# Altium schematic sheet teensyPlayback.SchDoc
size Legal
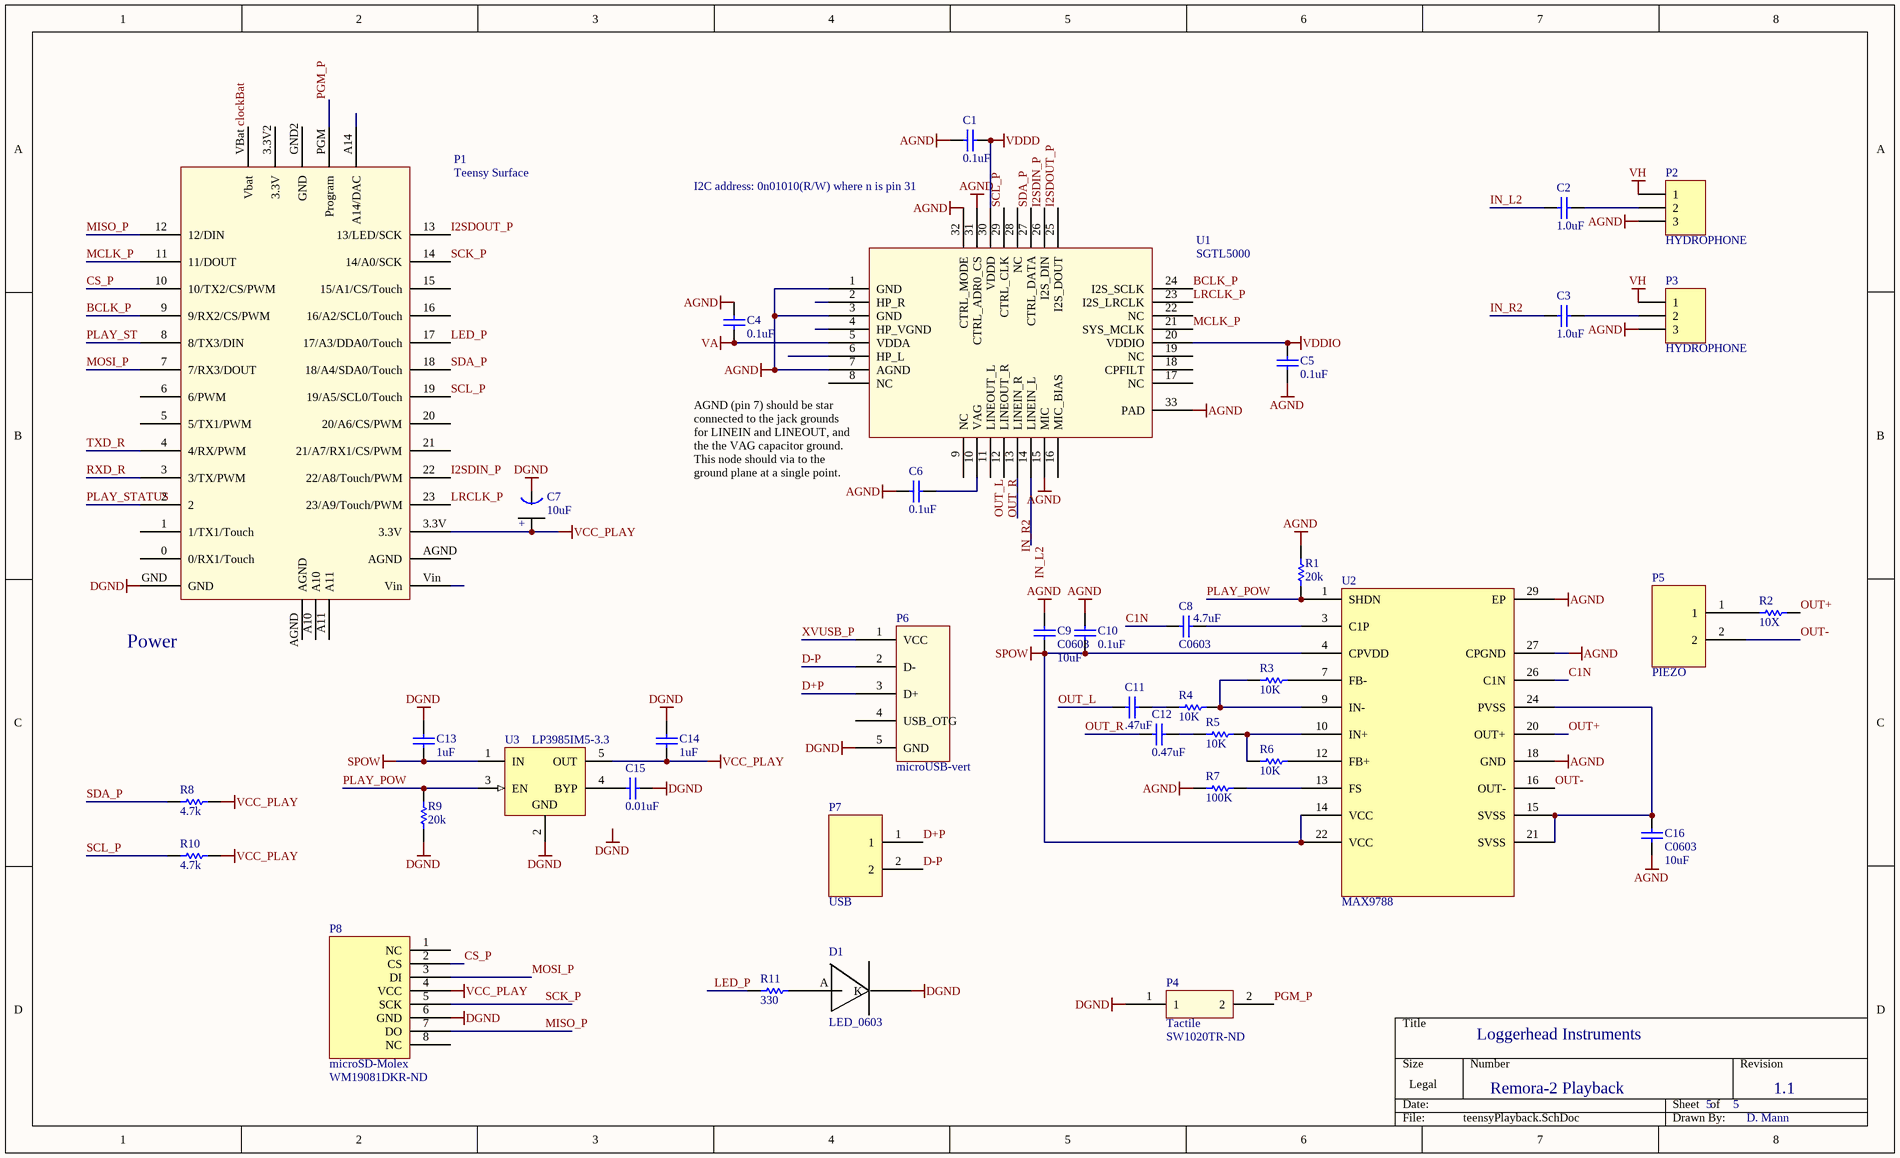
[diagram p0: teensyPlayback.SchDoc]

## Parts
C1  0.1uF  [0402]
C2  1.0uF  [0402]
C3  1.0uF  [0402]
C4  0.1uF  [0402]
C5  0.1uF  [0402]
C6  0.1uF  [0402]
C7  10uF  [Tant0805]
C8  C0603  value 4.7uF  [0603]
C9  C0603  value 10uF  [0603]
C10  0.1uF  [0402]
C11  .47uF  [0402]
C12  0.47uF  [0402]
C13  1uF  [0402]
C14  1uF  [0402]
C15  0.01uF  [0402]
C16  C0603  value 10uF  [0603]
D1  LED_0603  [Diode0603]
P1  Teensy Surface  [TEENSY3.2_surface_mount]
P2  HYDROPHONE  [HDR1X3]
P3  HYDROPHONE  [HDR1X3]
P4  Tactile  Supplier Part Number 1: SW1020TR-ND  [Tactile-B3U-1000]
P5  PIEZO  [HDR_2x1_2mm]
P6  microUSB-vert  [MICROUSB-VERT]
P7  USB  [HDR_2x1_2mm]
P8  microSD-Molex  Supplier Part Number 1: WM19081DKR-ND  [microSD_Molex_hinged]
R1  20k  [3-0603]
R2  10X  [3-0603]
R3  10K  [3-0603]
R4  10K  [3-0603]
R5  10K  [3-0603]
R6  10K  [3-0603]
R7  100K  [3-0603]
R8  4.7k  [3-0603]
R9  20k  [3-0603]
R10  4.7k  [3-0603]
R11  330  [3-0603]
U1  SGTL5000  [QFN32]
U2  MAX9788  [MAX9788]
U3  LP3985IM5-3.3  [MF05A_N]

## Nets
AGND: C1.2 C4.2 C5.2 C6.2 C9.1 C10.2 C16.1 P2.3 P3.3 R1.1 R7.1 U1.1(GND) U1.3(GND) U1.7(AGND) U1.15(MIC) U1.31(CTRL_ADR0_CS) U1.32(CTRL_MODE) U1.33(PAD) U2.18(GND) U2.27(CPGND) U2.29(EP)
DGND: C7.1(GND) C13.2 C14.2 C15.2 D1.K P1.GND P4.1 P6.5(GND) P8.6(GND) R9.1 U3.2(GND)
SPOW: C9.2 C10.1 C13.1 U2.4(CPVDD) U2.14(VCC) U2.22(VCC) U3.1(IN)
VA: C4.1 U1.5(VDDA)
VCC_PLAY: C7.2(+) C14.1 P1.3.3V P8.4(VCC) R8.2 R10.2 U3.5(OUT)
VDDD: C1.1 U1.30(VDDD)
VDDIO: C5.1 U1.20(VDDIO)
VH: P2.1 P3.1
BCLK_P: P1.9(9/RX2/CS/PWM) U1.24(I2S_SCLK)
C1N: C8.1 U2.26(C1N)
clockBat: P1.VBat(Vbat)
CS_P: P1.10(10/TX2/CS/PWM) P8.2(CS)
D+P: P6.3(D+) P7.1
D-P: P6.2(D-) P7.2
I2SDIN_P: P1.22(22/A8/Touch/PWM) U1.26(I2S_DIN)
I2SDOUT_P: P1.13(13/LED/SCK) U1.25(I2S_DOUT)
IN_L2: C2.2 U1.14(LINEIN_L)
IN_R2: C3.2 U1.13(LINEIN_R)
LED_P: P1.17(17/A3/DDA0/Touch) R11.1
LRCLK_P: P1.23(23/A9/Touch/PWM) U1.23(I2S_LRCLK)
MCLK_P: P1.11(11/DOUT) U1.21(SYS_MCLK)
MISO_P: P1.12(12/DIN) P8.7(DO)
MOSI_P: P1.7(7/RX3/DOUT) P8.3(DI)
OUT+: R2.1 U2.20(OUT+)
OUT-: P5.2 U2.16(OUT-)
OUT_L: C11.2 U1.11(LINEOUT_L)
OUT_R: C12.2 U1.12(LINEOUT_R)
PGM_P: P1.PGM(Program) P4.2
PLAY_POW: R1.2 R9.2 U2.1(SHDN) U3.3(EN)
PLAY_ST: P1.8(8/TX3/DIN)
PLAY_STATUS: P1.2
RXD_R: P1.3(3/TX/PWM)
SCK_P: P1.14(14/A0/SCK) P8.5(SCK)
SCL_P: P1.19(19/A5/SCL0/Touch) R10.1 U1.29(CTRL_CLK)
SDA_P: P1.18(18/A4/SDA0/Touch) R8.1 U1.27(CTRL_DATA)
TXD_R: P1.4(4/RX/PWM)
XVUSB_P: P6.1(VCC)
NetC2_1: C2.1 P2.2
NetC3_1: C3.1 P3.2
NetC6_1: C6.1 U1.10(VAG)
NetC8_2: C8.2 U2.3(C1P)
NetC11_1: C11.1 R4.1
NetC12_1: C12.1 R5.1
NetC15_1: C15.1 U3.4(BYP)
NetC16_2: C16.2 U2.15(SVSS) U2.21(SVSS) U2.24(PVSS)
NetD1_A: D1.A R11.2
NetP5_1: P5.1 R2.2
NetR3_1: R3.1 R4.2 U2.9(IN-)
NetR3_2: R3.2 U2.7(FB-)
NetR5_2: R5.2 R6.1 U2.10(IN+)
NetR6_2: R6.2 U2.12(FB+)
NetR7_2: R7.2 U2.13(FS)

Not connected (* = marked no-connect by the designer): P1 0(0/RX1/Touch) 1(1/TX1/Touch) 3.3V2(3.3V) 5(5/TX1/PWM) 6(6/PWM) 15(15/A1/CS/Touch) 16(16/A2/SCL0/Touch) 20(20/A6/CS/PWM) 21(21/A7/RX1/CS/PWM) A10 A11 A14(A14/DAC) AGND GND2(GND) Vin; P6 4(USB_OTG); P8 1(NC) 8(NC); U1 2(HP_R) 4(HP_VGND) 6(HP_L) 8(NC) 9(NC) 16(MIC_BIAS) 17(NC) 18(CPFILT) 19(NC) 22(NC) 28(NC)

## Notes on the sheet
- I2C address: 0n01010(R/W) where n is pin 31
- (near U1) AGND (pin 7) should be star connected to the jack grounds for LINEIN and LINEOUT, and the the VAG capacitor ground. This node should via to the ground plane at a single point.
- (near P1) Power
- Loggerhead Instruments
- Remora-2 Playback
- 5
- 1.1
- D. Mann
- Labels drawn without touching a wire or pin: DGND

## Library data of the parts
C1 C4-C6 C10 = C0402: Ceramic Chip Capacitor - Standard; Note: Footprint corresponds to dimensions for bulk cassette packaging. This case size has tightened tolerances.; Published: 17-Jul-2002; LatestRevisionDate: 19-Mar-2004; LatestRevisionNote: Silkscreen size reduced.; DatasheetDocument: Mar-2001; PackageDocument: Mar-2001; PackageReference: 0402; Publisher: Altium Limited; Code_JEITA: 0402; Code_IPC: 1005 [0402]; ComponentLink1Description: Manufacturer Link; ComponentLink1URL: http://www.kemet.com/; ComponentLink2Description: Datasheet; ComponentLink2URL: http://www.kemet.com/kemet/web/homepage/kechome.nsf/vapubfilesname/F3102TA.pdf/$file/F3102TA.pdf; Value: 0.1uF
C2 C3 C11-C15 = C0402: Ceramic Chip Capacitor - Standard; Note: Footprint corresponds to dimensions for bulk cassette packaging. This case size has tightened tolerances.; Value: 0.1uF; Published: 17-Jul-2002; LatestRevisionDate: 19-Mar-2004; LatestRevisionNote: Silkscreen size reduced.; DatasheetDocument: Mar-2001; PackageDocument: Mar-2001; PackageReference: 0402; Publisher: Altium Limited; Code_JEITA: 0402; Code_IPC: 1005 [0402]; ComponentLink1Description: Manufacturer Link; ComponentLink1URL: http://www.kemet.com/; ComponentLink2Description: Datasheet; ComponentLink2URL: http://www.kemet.com/kemet/web/homepage/kechome.nsf/vapubfilesname/F3102TA.pdf/$file/F3102TA.pdf
C7 = Tant0805: Value: 10uF
C8 C9 C16 = C0603: Ceramic Chip Capacitor - Standard; Note: Footprint corresponds to dimensions for bulk cassette packaging. This case size has tightened tolerances.; Published: 17-Jul-2002; LatestRevisionDate: 19-Mar-2004; LatestRevisionNote: Silkscreen size reduced.; DatasheetDocument: Mar-2001; PackageDocument: Mar-2001; PackageReference: 0603; Publisher: Altium Limited; Code_JEITA: 0603; Code_IPC: 1608 [0603]; ComponentLink1Description: Manufacturer Link; ComponentLink1URL: http://www.kemet.com/; ComponentLink2Description: Datasheet; ComponentLink2URL: http://www.kemet.com/kemet/web/homepage/kechome.nsf/vapubfilesname/F3102TA.pdf/$file/F3102TA.pdf
P1 = Teensy3.2_surface_mount
P2 P3 = Header 3: Header, 3-Pin; LatestRevisionDate: 17-Jul-2002; LatestRevisionNote: Re-released for DXP Platform.; Publisher: Altium Limited
P4 = Tactile_B3U-1000: Supplier 1: Digi-Key
P5 P7 = HDR_2x1_2mm: Charging Connector
P6 = microUSB-vert: Molex 105133-0011
P8 = microSD_Molex_hinged: Supplier 1: Digi-Key
R1-R11 = ERJ3RK: Precision Thick Film Chip Resistor, 10 Ohm to 1M Ohm Range, 1% and 0.5% Tolerance, 0603 Size, 0.063 W; Published: 17-Dec-2003; LatestRevisionDate: 19-Mar-2004; LatestRevisionNote: Silkscreen size reduced.; PackageDocument: Mar-2003; PackageReference: 3-0603; Publisher: Altium Limited; Code_IPC: 1608 [0603]; ComponentLink1Description: Manufacturer Link; ComponentLink1URL: http://www.panasonic.com/industrial/components/resistive_products.htm; ComponentLink2Description: Datasheet; ComponentLink2URL: http://www.panasonic.com/industrial/components/pdf/AOA0000CE2.pdf
U2 = MAX9788: audio amp
U3 = LP3985IM5-3.3: Micropower, 150mA Low-Noise Ultra Low-Dropout CMOS Voltage Regulator; Manufacturer: National Semiconductor; CompType: LDO IC; PackageTopMarking: LDQB*XTT; PowerWise: N; Published: 4-Dec-2008; DatasheetVersion: Aug-2005; PackageVersion: revD, Aug-2008; PackageReference: MF05A; Publisher: Altium Limited; PackageDescription: Molded SOT-23, .115 x .063 x .040 in Body, 5 Lead, .0375 in Pitch; PartNumber: LP3985IM5-3.3; RoHS: O; PinCount: 5; DigiKeyPartNumber: LP3985IM5-3.3CT-ND; ComponentLink1Description: LP3985 Datasheet; ComponentLink1URL: http://www.national.com/ds/LP/LP3985.pdf; ComponentLink2Description: LP3985 Web Page; ComponentLink2URL: http://www.national.com/pf/LP/LP3985.html; ComponentLink3Description: MF05A Package Page; ComponentLink3URL: http://www.national.com/packaging/folders/mf05a.html